# Altium schematic sheet ServoControl.SchDoc: Servo Control
size A4; DrawnBy: M. Small & J. Wilson; SheetNumber: 8; SheetTotal: 10
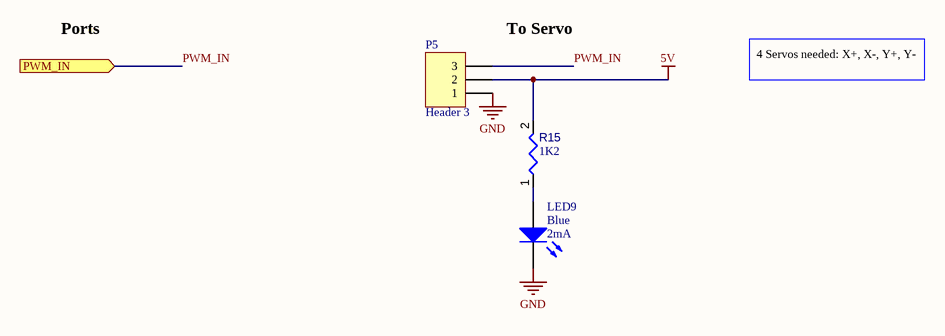
[diagram p0: ServoControl.SchDoc]

## Parts
LED9  Blue  IF: 2mA  [1206_A]
P5  Header 3  [HDR1X3]
R15  1K2  [RESC0805(2012)_L]

## Ports
PWM_IN (in)

## Nets
5V: P5.2 R15.2
GND: LED9.1(K) P5.1
PWM_IN: P5.3 ; port PWM_IN
NetLED9_2: LED9.2(A) R15.1

## Notes on the sheet
- Ports
- (near P5) To Servo
- 4 Servos needed: X+, X-, Y+, Y-
- Date:
- Sheet
- of
- Time:
- Revision:
- Drawn by:
- File:

## Library data of the parts
LED9 = CMP-1426-00015-1: KPT-3216LVVBC-D -  LED, 3.2mm x 1.6mm, Blue, SMD, 2 mA, 2.65 V, 470 nm; Manufacturer: Kingbright; ComponentLink2Description: Datasheet; PartNumber: KPT-3216LVVBC-D; ComponentLink1Description: Manufacturer URL; ComponentLink2URL: http://www.farnell.com/datasheets/2068439.pdf; PackageReference: 1206_A; Color: Blue; Element14 Order Code: 2610425
P5 = Header 3: Header, 3-Pin; LatestRevisionDate: 17-Jul-2002; LatestRevisionNote: Re-released for DXP Platform.; Publisher: Altium Limited
R15 = CMP-009-00076-1: 1K2 0.125W 5% 0805 (2012 Metric)  SMD; Mounting Technology: SMT; Power: 0.125W; Value: 1K2; Pins: 2; Case/Package: 0805; Tolerance: 5%